# Altium schematic sheet analog_osc.SchDoc
size A4
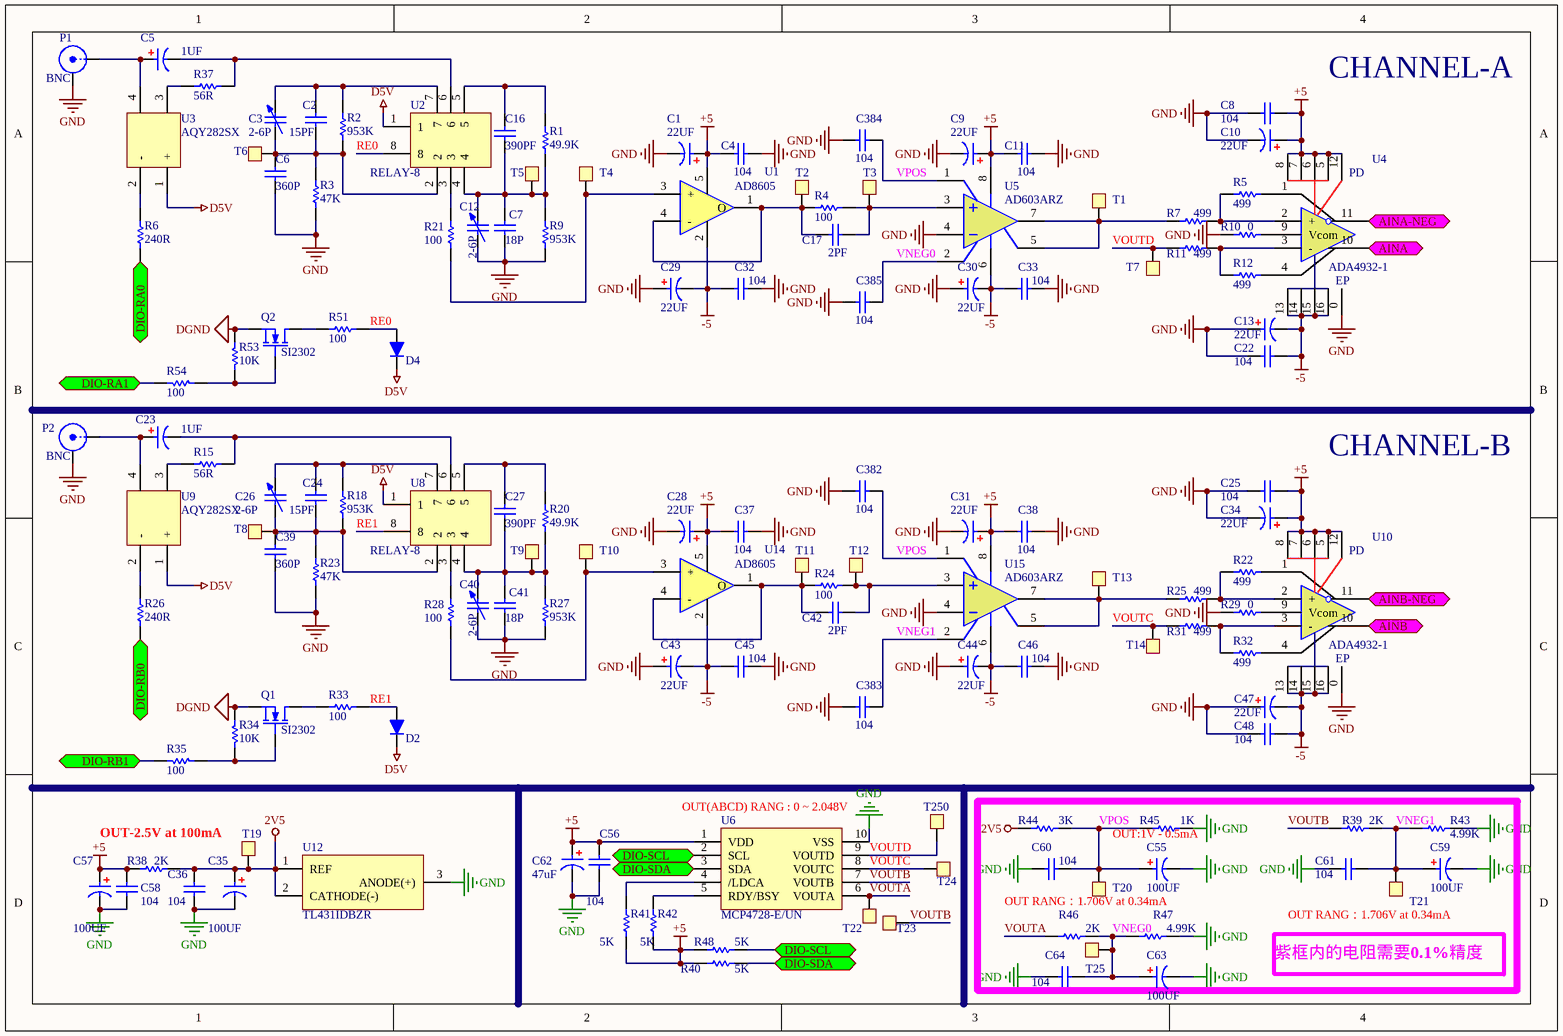
[diagram p0: analog_osc.SchDoc]

## Parts
C1  22UF  [0603C]
C2  15PF  [0603C]
C3  value 2-6P  [V-CAP]  (hidden comment: V_CAP)
C4  C104  [0402]  (value not drawn)
C5  1UF  [1812]
C6  360P  [0603C]
C7  18P  [0603C]
C8  C104  [0402]  (value not drawn)
C9  22UF  [0603C]
C10  22UF  [0603C]
C11  C104  [0402]  (value not drawn)
C12  value 2-6P  [V-CAP]  (hidden comment: V_CAP)
C13  22UF  [0603C]
C16  390PF  [0603C]
C17  2PF  [0603C]
C22  C104  [0402]  (value not drawn)
C23  1UF  [1812]
C24  15PF  [0603C]
C25  C104  [0402]  (value not drawn)
C26  value 2-6P  [V-CAP]  (hidden comment: V_CAP)
C27  390PF  [0603C]
C28  22UF  [0603C]
C29  22UF  [0603C]
C30  22UF  [0603C]
C31  22UF  [0603C]
C32  C104  [0402]  (value not drawn)
C33  C104  [0402]  (value not drawn)
C34  22UF  [0603C]
C35  100UF  [CAP-T-3630]
C36  C0.1uF  [0402]  (value not drawn)
C37  C104  [0402]  (value not drawn)
C38  C104  [0402]  (value not drawn)
C39  360P  [0603C]
C40  value 2-6P  [V-CAP]  (hidden comment: V_CAP)
C41  18P  [0603C]
C42  2PF  [0603C]
C43  22UF  [0603C]
C44  22UF  [0603C]
C45  C104  [0402]  (value not drawn)
C46  C104  [0402]  (value not drawn)
C47  22UF  [0603C]
C48  C104  [0402]  (value not drawn)
C55  100UF  [CAP-T-3630]
C56  C0.1uF  [0402]  (value not drawn)
C57  100UF  [CAP-T-3630]
C58  C0.1uF  [0402]  (value not drawn)
C59  100UF  [CAP-T-3630]
C60  C0.1uF  [0402]  (value not drawn)
C61  C0.1uF  [0402]  (value not drawn)
C62  47uF  [1206]
C63  100UF  [CAP-T-3630]
C64  C0.1uF  [0402]  (value not drawn)
C382  C104  [0402]  (value not drawn)
C383  C104  [0402]  (value not drawn)
C384  C104  [0402]  (value not drawn)
C385  C104  [0402]  (value not drawn)
D2  BAT54WS  [LC-SOD-323F]  (value not drawn)
D4  BAT54WS  [LC-SOD-323F]  (value not drawn)
P1  BNC  [BNC-OSC]
P2  BNC  [BNC-OSC]
Q1  SI2302  [SOT-23-3]
Q2  SI2302  [SOT-23-3]
R1  49.9K  [0603R]
R2  953K  [0603R]
R3  47K  [0603R]
R4  100  [0603R]
R5  499  [0402]
R6  240R  [0603R]
R7  499  [0402]
R9  953K  [0603R]
R10  0  [0603R]
R11  499  [0402]
R12  499  [0402]
R15  56R  [0603R]
R18  953K  [0603R]
R20  49.9K  [0603R]
R21  R100R  [0603R]  (value not drawn)
R22  499  [0402]
R23  47K  [0603R]
R24  100  [0603R]
R25  499  [0402]
R26  240R  [0603R]
R27  953K  [0603R]
R28  R100R  [0603R]  (value not drawn)
R29  0  [0603R]
R31  499  [0402]
R32  499  [0402]
R33  R100R  [0402]  (value not drawn)
R34  R10K  [0402]  (value not drawn)
R35  R100R  [0402]  (value not drawn)
R37  56R  [0603R]
R38  R2K  [0402]  (value not drawn)
R39  R2K  [0402]  (value not drawn)
R40  R5K  [0402]  (value not drawn)
R41  R5K  [0402]  (value not drawn)
R42  R5K  [0402]  (value not drawn)
R43  R4.99K  [0402]  (value not drawn)
R44  R3K  [0402]  (value not drawn)
R45  R1K  [0402]  (value not drawn)
R46  R2K  [0402]  (value not drawn)
R47  R4.99K  [0402]  (value not drawn)
R48  R5K  [0402]  (value not drawn)
R51  R100R  [0402]  (value not drawn)
R53  R10K  [0402]  (value not drawn)
R54  R100R  [0402]  (value not drawn)
T1  TP  [TEST_POINT]  (value not drawn)
T2  TP  [TEST_POINT]  (value not drawn)
T3  TP  [TEST_POINT]  (value not drawn)
T4  TP  [TEST_POINT]  (value not drawn)
T5  TP  [TEST_POINT]  (value not drawn)
T6  TP  [TEST_POINT]  (value not drawn)
T7  TP  [TEST_POINT]  (value not drawn)
T8  TP  [TEST_POINT]  (value not drawn)
T9  TP  [TEST_POINT]  (value not drawn)
T10  TP  [TEST_POINT]  (value not drawn)
T11  TP  [TEST_POINT]  (value not drawn)
T12  TP  [TEST_POINT]  (value not drawn)
T13  TP  [TEST_POINT]  (value not drawn)
T14  TP  [TEST_POINT]  (value not drawn)
T19  TP  [TEST_POINT]  (value not drawn)
T20  TP  [TEST_POINT]  (value not drawn)
T21  TP  [TEST_POINT]  (value not drawn)
T22  TP  [TEST_POINT]  (value not drawn)
T23  TP  [TEST_POINT]  (value not drawn)
T24  TP  [TEST_POINT]  (value not drawn)
T25  TP  [TEST_POINT]  (value not drawn)
T250  TP  [TEST_POINT]  (value not drawn)
U1  AD8605  [SOT23-5]
U2  RELAY-8  [RELAY-GS6-8]
U3  AQY282SX  [SOP4]
U4  ADA4932-1  [LFCSP-16]
U5  AD603ARZ  [SOP-8]
U6  MCP4728-E/UN  [MSOP10]
U8  RELAY-8  [RELAY-GS6-8]
U9  AQY282SX  [SOP4]
U10  ADA4932-1  [LFCSP-16]
U12  TL431IDBZR  [SOT-23-3]
U14  AD8605  [SOT23-5]
U15  AD603ARZ  [SOP-8]

## Blocks framed on the sheet
紫框内的电阻需要0.1%精度: C55 C59-C61 C63 C64 R39 R43-R47 T20 T21 T25

## Ports
AINA, AINA-NEG, AINB, AINB-NEG, DIO-RA0, DIO-RA1, DIO-RB0, DIO-RB1, DIO-SCL, DIO-SDA

## Nets
2V5: C35.1 C36.1 R38.2 R44.2 T19.1(R) U12.1(REF) U12.2(CATHODE(-))
+5: C1.1 C4.1 C8.2 C9.1 C10.1 C11.1 C25.2 C28.1 C31.1 C34.1 C37.1 C38.1 C56.1 C57.1 C58.1 C62.1 R38.1 R40.1 R41.1 R42.1 R48.2 U1.5(V+) U4.5 U4.6 U4.7 U4.8 U4.12(PD) U5.8(V+) U6.1(VDD) U10.5 U10.6 U10.7 U10.8 U10.12(PD) U14.5(V+) U15.8(V+)
-5: C13.2 C22.2 C29.2 C30.2 C32.1 C33.1 C43.2 C44.2 C45.1 C46.1 C47.2 C48.2 U1.2(V-) U4.13 U4.14 U4.15 U4.16 U5.6(V-) U10.13 U10.14 U10.15 U10.16 U14.2(V-) U15.6(V-)
D5V: D2.2(K) D4.2(K) U2.1 U3.1(+) U8.1 U9.1(+)
DGND: Q1.2(S) Q2.2(S) R34.2 R53.2
GND: C1.2 C4.2 C6.2 C7.2 C8.1 C9.2 C10.2 C11.2 C12.1 C13.1 C22.1 C25.1 C28.2 C29.1 C30.1 C31.2 C32.2 C33.2 C34.2 C35.2 C36.2 C37.2 C38.2 C39.2 C40.1 C41.2 C43.1 C44.1 C45.2 C46.2 C47.1 C48.1 C55.2 C56.2 C57.2 C58.2 C59.2 C60.1 C61.1 C62.2 C63.2 C64.1 C382.1 C383.1 C384.1 C385.1 P1.2(Y) P2.2(Y) R3.2 R9.2 R10.1 R23.2 R27.2 R29.1 R43.1 R45.1 R47.1 U4.0(EP) U5.4(IN-) U6.10(VSS) U10.0(EP) U12.3(ANODE(+)) U15.4(IN-)
AINA: U4.10 ; port AINA
AINA-NEG: U4.11 ; port AINA-NEG
AINB: U10.10 ; port AINB
AINB-NEG: U10.11 ; port AINB-NEG
DIO-RA0: R6.1 ; port DIO-RA0
DIO-RA1: R54.2 ; port DIO-RA1
DIO-RB0: R26.1 ; port DIO-RB0
DIO-RB1: R35.2 ; port DIO-RB1
DIO-SCL: R48.1 U6.2(SCL) ; port DIO-SCL
DIO-SDA: R40.2 U6.3(SDA) ; port DIO-SDA
RE0: D4.1(A) R51.2 U2.8
RE1: D2.1(A) R33.2 U8.8
VNEG0: C63.1 C64.2 C385.2 R46.1 R47.2 T25.1(R) U5.2(G-)
VNEG1: C59.1 C61.2 C383.2 R39.1 R43.2 T21.1(R) U15.2(G-)
VOUTA: R46.2 T22.1(R) U6.6(VOUTA)
VOUTB: R39.2 T23.1(R) U6.7(VOUTB)
VOUTC: R31.1 T14.1(R) T24.1(R) U6.8(VOUTC)
VOUTD: R11.1 T7.1(R) T250.1(R) U6.9(VOUTD)
VPOS: C55.1 C60.2 C382.2 C384.2 R44.1 R45.2 T20.1(R) U5.1(G+) U15.1(G+)
NetC2_1: C2.1 C3.2 R2.1 U2.7
NetC2_2: C2.2 C3.1 C6.1 R2.2 R3.1 T6.1(R) U2.2
NetC5_1: C5.1 P1.1(X) U3.4
NetC5_2: C5.2 R37.2 U2.6
NetC7_1: C7.1 C12.2 C16.2 R1.2 R9.1 T5.1(R) U2.4
NetC16_1: C16.1 R1.1 U2.5
NetC17_1: C17.1 R4.1 T2.1(R) U1.1(O) U1.4(-)
NetC17_2: C17.2 R4.2 T3.1(R) U5.3(IN+)
NetC23_1: C23.1 P2.1(X) U9.4
NetC23_2: C23.2 R15.2 U8.6
NetC24_1: C24.1 C26.2 R18.1 U8.7
NetC24_2: C24.2 C26.1 C39.1 R18.2 R23.1 T8.1(R) U8.2
NetC27_1: C27.1 R20.1 U8.5
NetC27_2: C27.2 C40.2 C41.1 R20.2 R27.1 T9.1(R) U8.4
NetC42_1: C42.1 R24.1 T11.1(R) U14.1(O) U14.4(-)
NetC42_2: C42.2 R24.2 T12.1(R) U15.3(IN+)
NetQ1_1: Q1.1(G) R34.1 R35.1
NetQ1_3: Q1.3(D) R33.1
NetQ2_1: Q2.1(G) R53.1 R54.1
NetQ2_3: Q2.3(D) R51.1
NetR5_1: R5.1 R7.2 U4.2(+)
NetR5_2: R5.2 U4.1
NetR6_2: R6.2 U3.2(-)
NetR7_1: R7.1 T1.1(R) U5.5(FB) U5.7(OUT)
NetR10_2: R10.2 U4.9(Vcom)
NetR11_2: R11.2 R12.1 U4.3(-)
NetR12_2: R12.2 U4.4
NetR15_1: R15.1 U9.3
NetR21_1: R21.1 U2.3
NetR21_2: R21.2 T4.1(R) U1.3(+)
NetR22_1: R22.1 R25.2 U10.2(+)
NetR22_2: R22.2 U10.1
NetR25_1: R25.1 T13.1(R) U15.5(FB) U15.7(OUT)
NetR26_2: R26.2 U9.2(-)
NetR28_1: R28.1 U8.3
NetR28_2: R28.2 T10.1(R) U14.3(+)
NetR29_2: R29.2 U10.9(Vcom)
NetR31_2: R31.2 R32.1 U10.3(-)
NetR32_2: R32.2 U10.4
NetR37_1: R37.1 U3.3
NetR41_2: R41.2 U6.4(/LDCA)
NetR42_2: R42.2 U6.5(RDY/BSY)

## Notes on the sheet
- CHANNEL-A
- CHANNEL-B
- OUT-2.5V at 100mA
- (near U6) OUT(ABCD) RANG : 0 ~ 2.048V
- (near R45) OUT:1V - 0.5mA
- (near T20) OUT RANG：1.706V at 0.34mA
- OUT RANG：1.706V at 0.34mA
- (in symbol C0.1uF) 104
- (in symbol R10K) 2K; 5K; 3K; 1K; 4.99K; 10K
- (in symbol R100R) 100

## Library data of the parts
C1 C5 C9 C10 C13 C23 C28-C31 C34 C35 C43 C44 C47 C55 C57 C59 C62 C63 = C10uF: 贴片电容
C2 C4 C6-C8 C11 C16 C17 C22 C24 C25 C27 C32 C33 C37-C39 C41 C42 C45 C46 C48 C382-C385 = C0.1uF: 贴片电容
C3 C12 C26 C40 = Cap Var: Variable or Adjustable Capacitor; Published: 24-Mar-1999; LatestRevisionDate: 29-May-2009; LatestRevisionNote: IPC-7351 Footprint Added.; PackageReference: C1210; Publisher: Altium Limited; PackageDescription: Chip Capacitor 1210 Case Size; Code_JEITA: 1210; Code_IPC: CAPC3225
D2 D4 = Diode
P1 P2 = BNC: BNC Elbow Connector; LatestRevisionDate: 17-Jul-2002; LatestRevisionNote: Re-released for DXP Platform.; Publisher: Altium Limited
Q1 Q2 = MOSFET-N
R1-R7 R9-R12 R15 R18 R20 R22-R27 R29 R31 R32 R37 = R1M
R38-R48 = R10K